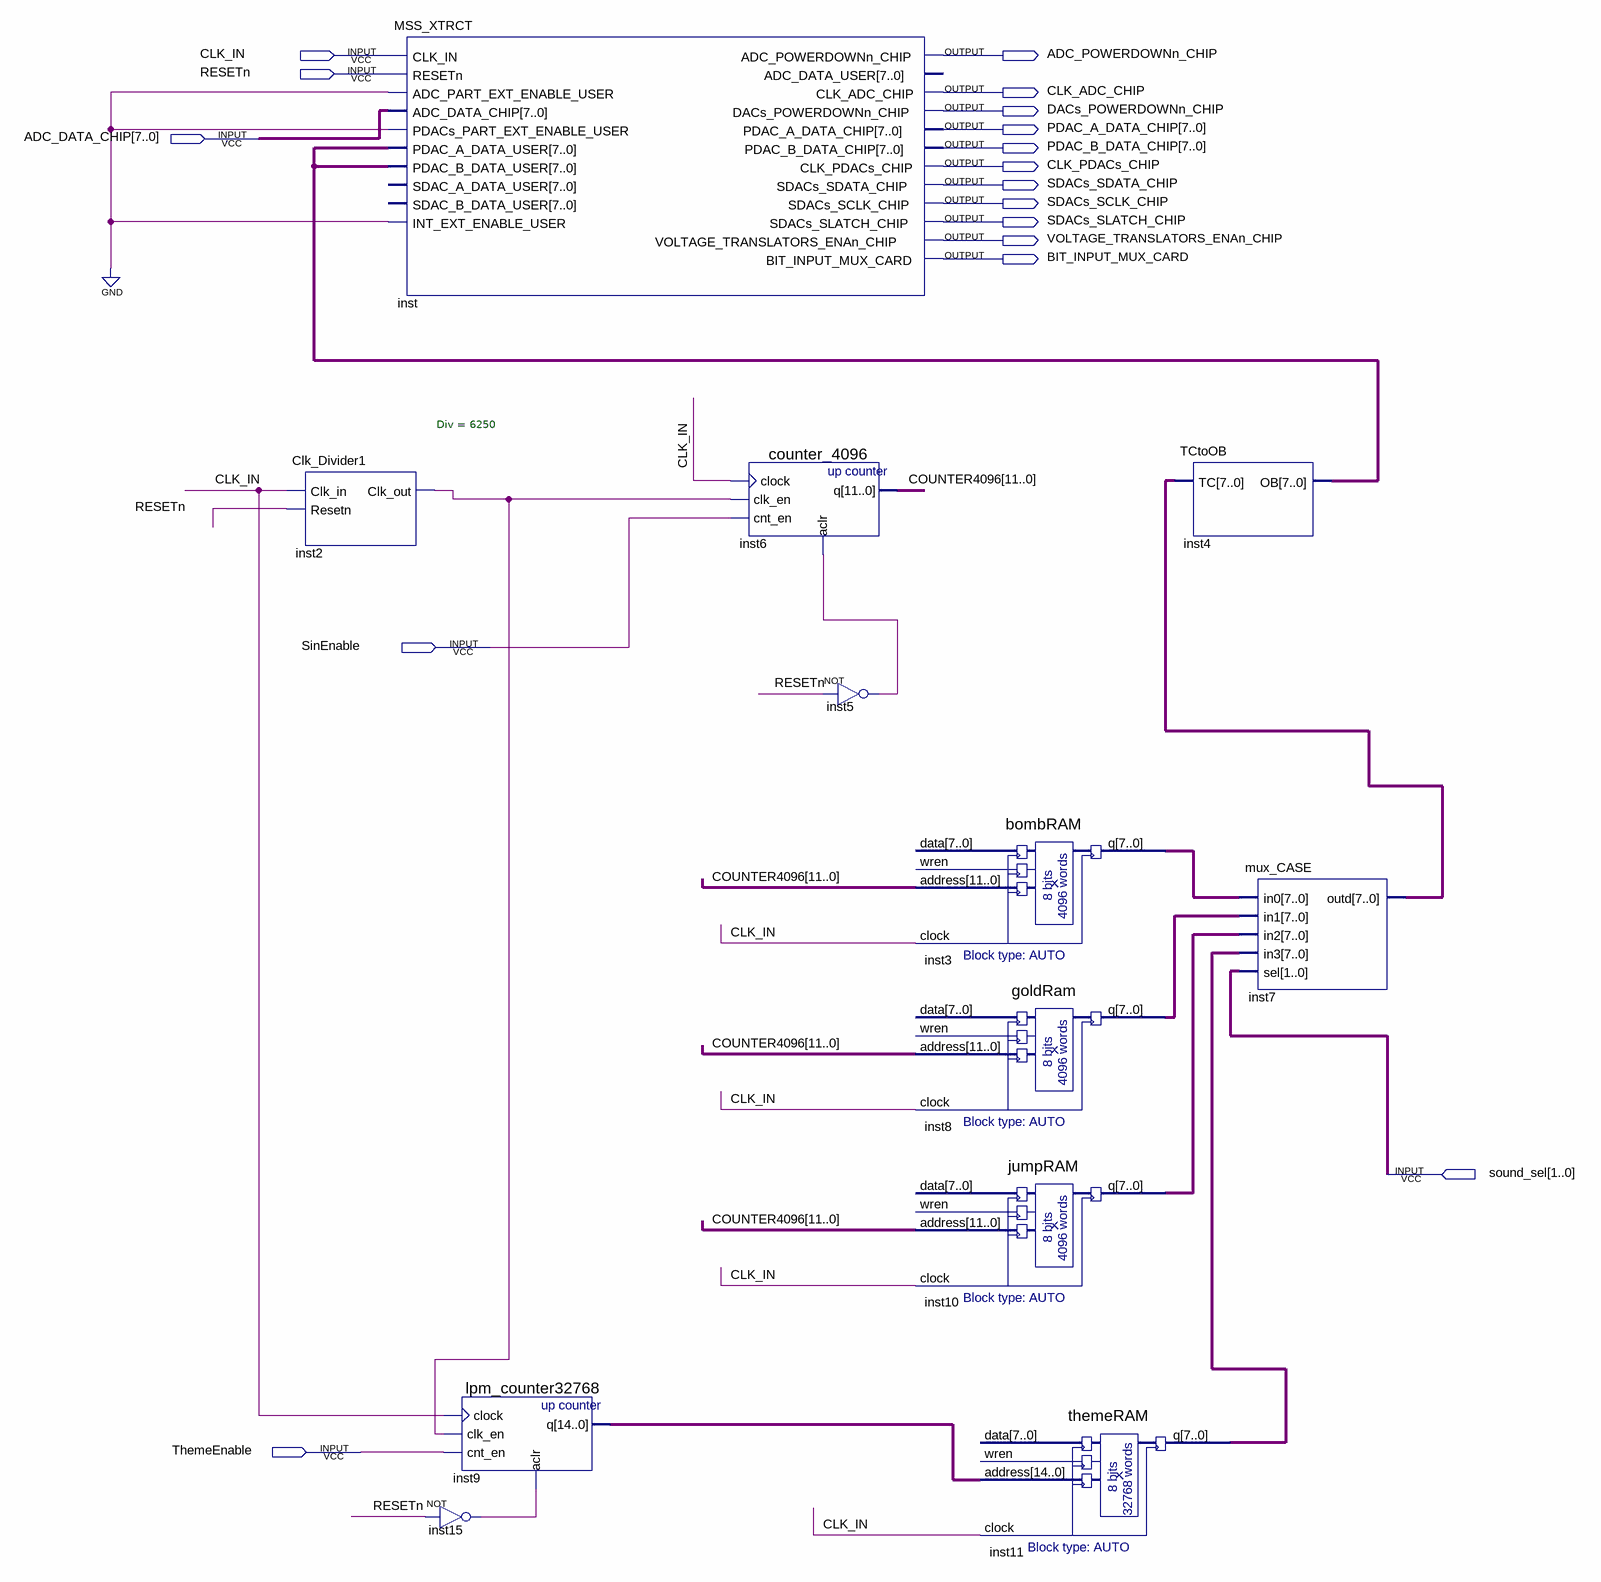
[diagram p0: schematic sheet]
// Quartus schematic MarioSound.bdf as structural Verilog: 12 symbols, 17 pins
module MarioSound (
  input  CLK_IN,
  input  RESETn,
  input  [7:0] ADC_DATA_CHIP,
  input  SinEnable,
  input  [1:0] sound_sel,
  input  ThemeEnable,
  output ADC_POWERDOWNn_CHIP,
  output CLK_ADC_CHIP,
  output DACs_POWERDOWNn_CHIP,
  output [7:0] PDAC_A_DATA_CHIP,
  output [7:0] PDAC_B_DATA_CHIP,
  output CLK_PDACs_CHIP,
  output SDACs_SDATA_CHIP,
  output SDACs_SCLK_CHIP,
  output SDACs_SLATCH_CHIP,
  output VOLTAGE_TRANSLATORS_ENAn_CHIP,
  output BIT_INPUT_MUX_CARD
);

  wire inst2_clk_out, inst5_out, inst15_out;
  wire [7:0] inst3_q, inst4_ob, inst7_outd, inst8_q, inst10_q, inst11_q;
  wire [11:0] COUNTER4096;
  wire [14:0] inst9_q;

  Clk_Divider1 #(.Div(6250)) inst2 (.Clk_in(CLK_IN), .Resetn(RESETn), .Clk_out(inst2_clk_out));
  MSS_XTRCT inst (
    .CLK_IN(CLK_IN), .RESETn(RESETn), .ADC_PART_EXT_ENABLE_USER(1'b0), .ADC_DATA_CHIP(ADC_DATA_CHIP),
    .PDACs_PART_EXT_ENABLE_USER(1'b0), .PDAC_A_DATA_USER(inst4_ob), .PDAC_B_DATA_USER(inst4_ob),
    .INT_EXT_ENABLE_USER(1'b0), .ADC_POWERDOWNn_CHIP(ADC_POWERDOWNn_CHIP), .CLK_ADC_CHIP(CLK_ADC_CHIP),
    .DACs_POWERDOWNn_CHIP(DACs_POWERDOWNn_CHIP), .PDAC_A_DATA_CHIP(PDAC_A_DATA_CHIP),
    .PDAC_B_DATA_CHIP(PDAC_B_DATA_CHIP), .CLK_PDACs_CHIP(CLK_PDACs_CHIP),
    .SDACs_SDATA_CHIP(SDACs_SDATA_CHIP), .SDACs_SCLK_CHIP(SDACs_SCLK_CHIP),
    .SDACs_SLATCH_CHIP(SDACs_SLATCH_CHIP), .VOLTAGE_TRANSLATORS_ENAn_CHIP(VOLTAGE_TRANSLATORS_ENAn_CHIP),
    .BIT_INPUT_MUX_CARD(BIT_INPUT_MUX_CARD));  // open: SDAC_A_DATA_USER, SDAC_B_DATA_USER, ADC_DATA_USER
  lpm_counter32768 inst9 (.clock(CLK_IN), .clk_en(inst2_clk_out), .cnt_en(ThemeEnable), .aclr(inst15_out), .q(inst9_q));
  not inst15 (inst15_out, RESETn);
  counter_4096 inst6 (.clock(CLK_IN), .clk_en(inst2_clk_out), .cnt_en(SinEnable), .aclr(inst5_out), .q(COUNTER4096));
  not inst5 (inst5_out, RESETn);
  bombRAM inst3 (.address(COUNTER4096), .clock(CLK_IN), .q(inst3_q));  // open: data, wren
  goldRam inst8 (.address(COUNTER4096), .clock(CLK_IN), .q(inst8_q));  // open: data, wren
  jumpRAM inst10 (.address(COUNTER4096), .clock(CLK_IN), .q(inst10_q));  // open: data, wren
  themeRAM inst11 (.address(inst9_q), .clock(CLK_IN), .q(inst11_q));  // open: data, wren
  TCtoOB inst4 (.TC(inst7_outd), .OB(inst4_ob));
  mux_CASE inst7 (.in0(inst3_q), .in1(inst8_q), .in2(inst10_q), .in3(inst11_q), .sel(sound_sel), .outd(inst7_outd));
endmodule
